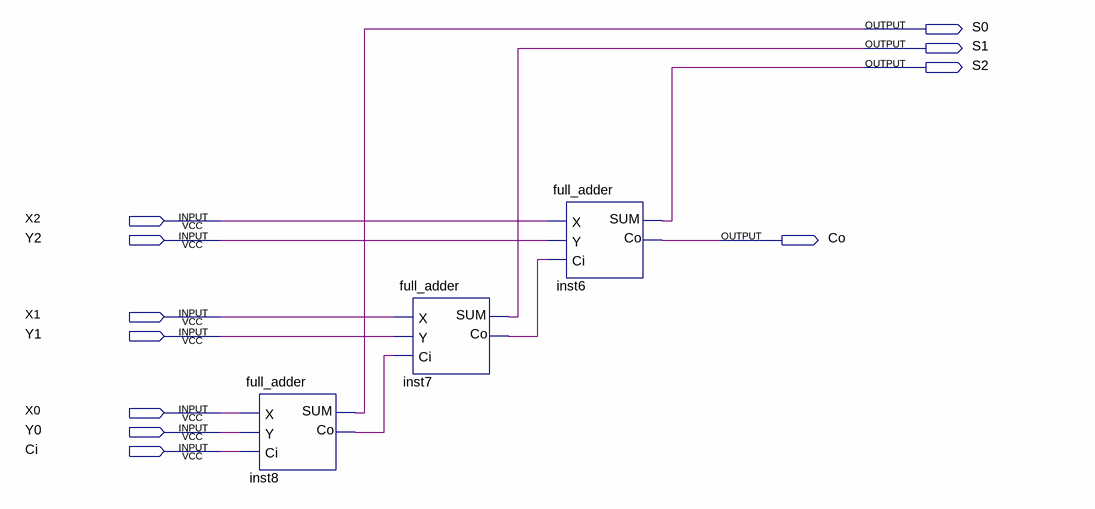
[diagram p0: schematic sheet]
// Quartus schematic 3bit_Adder.bdf as structural Verilog: 3 symbols, 11 pins
module \3bit_Adder  (
  input  X2,
  input  Y2,
  input  X1,
  input  Y1,
  input  X0,
  input  Y0,
  input  Ci,
  output S0,
  output S1,
  output S2,
  output Co
);

  wire inst7_co, inst8_co;

  full_adder inst8 (.X(X0), .Y(Y0), .Ci(Ci), .SUM(S0), .Co(inst8_co));
  full_adder inst7 (.X(X1), .Y(Y1), .Ci(inst8_co), .SUM(S1), .Co(inst7_co));
  full_adder inst6 (.X(X2), .Y(Y2), .Ci(inst7_co), .SUM(S2), .Co(Co));
endmodule
